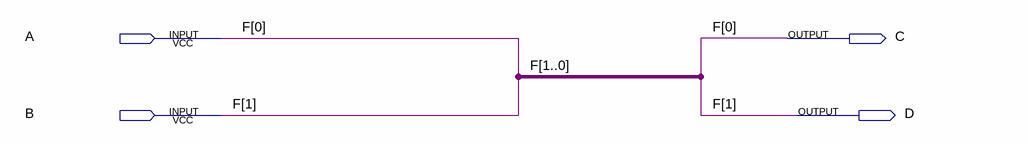
[diagram p0: schematic sheet]
// Quartus schematic teste_fios.bdf as structural Verilog: 0 symbols, 4 pins
module teste_fios (
  input  A,
  input  B,
  output C,
  output D
);


  assign C = A;
  assign D = B;

  // Other names for the same wires on the sheet: F[1:0] = {B, A}
endmodule
